# Altium schematic sheet DigitalCarrierJack.SchDoc
size A4; CompanyName: Technische Hochschule Nürnberg Georg Simon Ohm; DrawnBy: Bauer Martin; Engineer: Bauer Martin; Organization: UltraZohm; Address1: Kesslerplatz 12; Address2: 90489 Nürnberg; Address3: GERMANY; DocumentNumber: 2; SheetNumber: 2; SheetTotal: 6; Website: www.ultrazohm.com
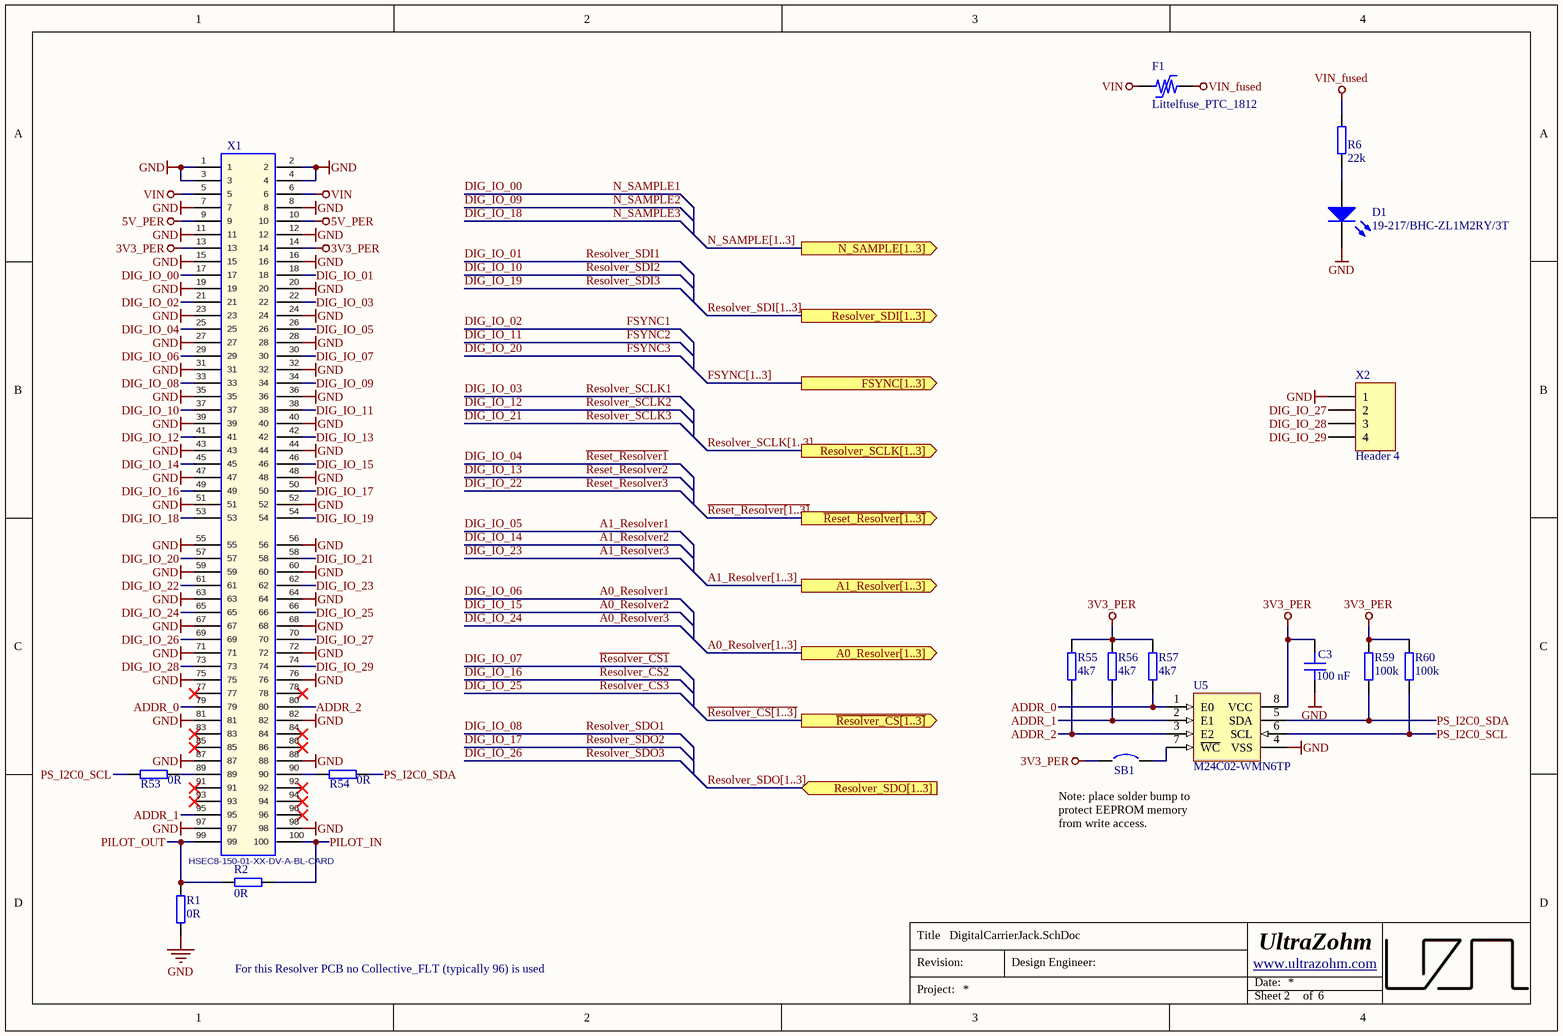
[diagram p0: DigitalCarrierJack.SchDoc]

## Parts
C3  100 nF  [C_0603]
D1  19-217/BHC-ZL1M2RY/3T  [WL-SMCW_0603]
F1  Littelfuse_PTC_1812  [1812_PTC_Polyfuse_Littelfuse]
R1  0R  [RES 0603_1608]
R2  0R  [RES 0603_1608]
R6  22k  [RES 0603_1608]
R53  0R  [RES 0603_1608]
R54  0R  [RES 0603_1608]
R55  4k7  [RES 0603_1608]
R56  4k7  [RES 0603_1608]
R57  4k7  [RES 0603_1608]
R59  100k  [RES 0603_1608]
R60  100k  [RES 0603_1608]
SB1  Solder Bump 0603  [SB_0603]  (value not drawn)  (no BOM)
U5  M24C02-WMN6TP  [D0008A_N]
X1  HSEC8-150-01-XX-DV-A-BL-CARD  [HSEC8-150-01-XX-DV-A-BL-CARD]  (no BOM)
X2  Header 4  [HDR1X4]

## Ports
A0_Resolver[1..3] (out), A1_Resolver[1..3] (out), FSYNC[1..3] (out), N_SAMPLE[1..3] (out), Resolver_SCLK[1..3] (out), Resolver_SDI[1..3] (out), Resolver_SDO[1..3] (in), ~{Reset_Resolver[1..3]} (out), ~{Resolver_CS[1..3]} (out)

## Nets
3V3_PER: C3.1 R55.2 R56.2 R57.2 R59.2 R60.2 SB1.1 U5.8(VCC) X1.13 X1.14
5V_PER: X1.9 X1.10
GND: C3.2 D1.1(K) R1.1 U5.4(VSS) X1.1 X1.2 X1.3 X1.4 X1.7 X1.8 X1.11 X1.12 X1.15 X1.16 X1.19 X1.20 X1.23 X1.24 X1.27 X1.28 X1.31 X1.32 X1.35 X1.36 X1.39 X1.40 X1.43 X1.44 X1.47 X1.48 X1.51 X1.52 X1.55 X1.56 X1.59 X1.60 X1.63 X1.64 X1.67 X1.68 X1.71 X1.72 X1.75 X1.76 X1.81 X1.82 X1.87 X1.88 X1.97 X1.98 X2.1
VIN: F1.1 X1.5 X1.6
VIN_fused: F1.2 R6.2
~{Reset_Resolver1}: X1.25  [also labelled DIG_IO_04]
~{Reset_Resolver2}: X1.42  [also labelled DIG_IO_13]
~{Reset_Resolver3}: X1.61  [also labelled DIG_IO_22]
~{Resolver_CS1}: X1.30  [also labelled DIG_IO_07]
~{Resolver_CS2}: X1.49  [also labelled DIG_IO_16]
~{Resolver_CS3}: X1.66  [also labelled DIG_IO_25]
A0_Resolver1: X1.29  [also labelled DIG_IO_06]
A0_Resolver2: X1.46  [also labelled DIG_IO_15]
A0_Resolver3: X1.65  [also labelled DIG_IO_24]
A1_Resolver1: X1.26  [also labelled DIG_IO_05]
A1_Resolver2: X1.45  [also labelled DIG_IO_14]
A1_Resolver3: X1.62  [also labelled DIG_IO_23]
ADDR_0: R57.1 U5.1(E0) X1.79
ADDR_1: R56.1 U5.2(E1) X1.95
ADDR_2: R55.1 U5.3(E2) X1.80
DIG_IO_00: X1.17  [also labelled N_SAMPLE1]
DIG_IO_01: X1.18  [also labelled Resolver_SDI1]
DIG_IO_02: X1.21  [also labelled FSYNC1]
DIG_IO_03: X1.22  [also labelled Resolver_SCLK1]
DIG_IO_08: X1.33  [also labelled Resolver_SDO1]
DIG_IO_09: X1.34  [also labelled N_SAMPLE2]
DIG_IO_10: X1.37  [also labelled Resolver_SDI2]
DIG_IO_11: X1.38  [also labelled FSYNC2]
DIG_IO_12: X1.41  [also labelled Resolver_SCLK2]
DIG_IO_17: X1.50  [also labelled Resolver_SDO2]
DIG_IO_18: X1.53  [also labelled N_SAMPLE3]
DIG_IO_19: X1.54  [also labelled Resolver_SDI3]
DIG_IO_20: X1.57  [also labelled FSYNC3]
DIG_IO_21: X1.58  [also labelled Resolver_SCLK3]
DIG_IO_26: X1.69  [also labelled Resolver_SDO3]
DIG_IO_27: X1.70 X2.2
DIG_IO_28: X1.73 X2.3
DIG_IO_29: X1.74 X2.4
PILOT_IN: R2.2 X1.100
PILOT_OUT: R1.2 R2.1 X1.99
PS_I2C0_SCL: R53.1 R60.1 U5.6(SCL)
PS_I2C0_SDA: R54.2 R59.1 U5.5(SDA)
NetD1_2: D1.2(A) R6.1
NetR53_2: R53.2 X1.89
NetR54_1: R54.1 X1.90
NetSB1_2: SB1.2 U5.7(~{WC})

Not connected (* = marked no-connect by the designer): X1 77* 78* 83* 84* 85* 86* 91* 92* 93* 94* 96*

## Buses and harness runs
bus A0_Resolver[1..3] = port A0_Resolver[1..3]
bus A1_Resolver[1..3] = port A1_Resolver[1..3]
bus FSYNC[1..3] = port FSYNC[1..3]
bus N_SAMPLE[1..3] = port N_SAMPLE[1..3]
bus Resolver_SCLK[1..3] = port Resolver_SCLK[1..3]
bus Resolver_SDI[1..3] = port Resolver_SDI[1..3]
bus Resolver_SDO[1..3] = port Resolver_SDO[1..3]
bus ~{Reset_Resolver[1..3]} = port ~{Reset_Resolver[1..3]}
bus ~{Resolver_CS[1..3]} = port ~{Resolver_CS[1..3]}

## Notes on the sheet
- Note: place solder bump to protect EEPROM memory from write access.
- For this Resolver PCB no Collective_FLT (typically 96) is used
- Title
- Revision:
- Design Engineer:
- Date:
- Project:
- Sheet
- of

## Library data of the parts
C3 = C0603C104K9PACTU: Capacitor 0603, 6.3 VDC, 100 nF, X5R; Manufacturer: KEMET; Tolerance: 10 %; Voltage Rating: 6.3 VDC; Created from: MGremer; Manufacturer Part Number: C0603C104K9PACTU; PartID: 70; Created On: 20.12.2020 13:54:13; ComponentLink1Description: Datasheet; ComponentLink1URL: https://www.mouser.de/datasheet/2/212/KEM_C1006_X5R_SMD-1103249.pdf; Component Type: Capacitor 0603; Device Package: 0603; Last Updated: 20.01.2021 13:57:36; Mounting Type: SMD; Operating Temperature: -55 - 85°C; Series: SMD Comm X5R; Supplier 1: Mouser; Supplier Part Number 1: 80-C0603C104K9P; Type: Capacitor; Value: 100 nF; Live Cycle Status: 1; Stock number: not stored
D1 = 19-217/BHC-ZL1M2RY/3T: LED BLUE 465~475NM 11.5~28.5MCD@5MA TOP VIEW 0603 ROHS; Manufacturer: Everlight Elec; Type: Standard; Created from: T. Wendt; Forward Current I_f: 20 mA; Forward Voltage U_f: 2.8 V; Wavelength: 470 nm; Nominal Power: 68 mW; Manufacturer Part Number: 19-217/BHC-ZL1M2RY/3T; PartID: 6; Created On: 03.03.2021 09:59:51; ComponentLink1Description: Datasheet; ComponentLink1URL: https://datasheet.lcsc.com/szlcsc/Everlight-Elec-19-217-BHC-ZL1M2RY-3T_C72041.pdf; Component Type: LED Diode; Device Package: 0603; Last Updated: 04.03.2021 09:02:49; Mounting Type: SMD; Operating Temperature: -40 - 85 °C; Supplier 1: LCSC; Supplier Part Number 1: C72041; Live Cycle Status: 1; Stock number: not stored; Color: blue; Light Intensity: 28.5 mcd; LCSC Part Number: C72041
F1 = Littelfuse_PTC_1812: POLYSWITCH RESETTABLE DEVICES; MPN: miniASMDC110F/24; Value: PTC, 1.1 A, 24V; Voltage: 24V; Trip Current: 2.2A; Hold Current: 1.1A; Resistance: 0.18 Ohm; Type: Fuse; Nominal current: 1 A; Created from: MHlatky; MF: Littelfuse; Created: 2019_02_10_AGeiger; Package: 1812; ComponentLink1URL: https://www.littelfuse.com/~/media/electronics/datasheets/resettable_ptcs/littelfuse_ptc_surface_mount_catalog_datasheet.pdf.pdf; ComponentLink1Description: Datasheet; Manufacturer Part Number: Littelfuse_PTC_1812; PartID: 5; Created On: 07.05.2021 06:50:33; Component Type: Littelfuse_PTC_1812; Last Updated: 27.05.2022 15:06:17; Manufacturer: Littelfuse; Mounting Type: SMD; Operating Temperature: -40 - 85 °C; Supplier 1: Mouser; Supplier Part Number 1: 530-0ZCG0150BF2C; Live Cycle Status: 1; LCSC Part Number: C70119
R1 R2 R53 R54 = RC0603JR-070RL: SMD resistor E24 series; Manufacturer: YAGEO; Tolerance: 5%; Created from: MGremer; Supplier 1: Mouser; ComponentLink1Description: Datasheet; ComponentLink1URL: https://www.mouser.de/datasheet/2/447/PYu-RC_Group_51_RoHS_L_10-1664068.pdf; Value: 0R; Supplier Part Number 1: 603-RC0603JR-070RL; Manufacturer Part Number: RC0603JR-070RL; PartID: 1; Created On: 14.12.2020 16:17:14; Component Type: SMD resistor; Device Package: 0603; Last Updated: 04.03.2021 09:09:42; Mounting Type: SMD; Supplier 2: LCSC; Supplier Part Number 2: C21189; Type: Resistor; Live Cycle Status: 1; Stock number: Labor SMD Container; LCSC Part Number: C21189
R6 = RK73B1JTTD223J: SMD resistor E24 series; Manufacturer: KOA Speer; Tolerance: 5%; Created from: MGremer; Value: 22k; Supplier 1: Mouser; Supplier Part Number 1: 660-RK73B1JTTD223J; Manufacturer Part Number: RK73B1JTTD223J; PartID: 106; Created On: 14.12.2020 16:17:14; ComponentLink1Description: Datasheet; ComponentLink1URL: https://www.mouser.de/datasheet/2/219/RK73B-1825463.pdf; Component Type: SMD resistor; Device Package: 0603; Last Updated: 01.02.2023 09:52:31; Mounting Type: SMD; Type: Resistor; Live Cycle Status: 1; Stock number: Labor SMD Container; LCSC Part Number: C31850
R55-R57 = 0603WAF4701T5E: SMD resistor E24 series; Manufacturer: UNI-ROYAL; Tolerance: 1%; Created from: AGeiger; Manufacturer Part Number: 0603WAF4701T5E; PartID: 90; Created On: 14.12.2020 16:17:14; ComponentLink1Description: Datasheet; ComponentLink1URL: https://datasheet.lcsc.com/lcsc/2206010116_UNI-ROYAL-Uniroyal-Elec-0603WAF4701T5E_C23162.pdf; Component Type: SMD resistor; Device Package: 0603; Last Updated: 25.08.2022 20:03:04; Mounting Type: SMD; Supplier 1: LCSC; Supplier Part Number 1: C23162; Type: Resistor; Value: 4k7; Live Cycle Status: 1; Stock number: Labor SMD Container; LCSC Part Number: C23162
R59 R60 = RK73B1JTTD104J: SMD resistor E24 series; Manufacturer: KOA Speer; Tolerance: 5%; Created from: MGremer; Manufacturer Part Number: RK73B1JTTD104J; PartID: 122; Created On: 14.12.2020 16:17:14; ComponentLink1Description: Datasheet; ComponentLink1URL: https://www.mouser.de/datasheet/2/219/RK73B-1825463.pdf; Component Type: SMD resistor; Device Package: 0603; Last Updated: 27.05.2022 14:04:10; Mounting Type: SMD; Supplier 1: Mouser; Supplier Part Number 1: 660-RK73B1JTTD104J; Type: Resistor; Value: 100k; Live Cycle Status: 1; Stock number: Labor SMD Container; LCSC Part Number: C25803
SB1 = =Value: Created from: AGeiger; Revision: July-2002: Re-released for DXP Platform.; PartID: 1; Created On: 09.01.2024 17:13:56; Component Type: Solder Bump; Device Package: 0603; Last Updated: 09.01.2024 17:13:56; Manufacturer Part Number: Solder Bump 0603; Mounting Type: SMD; Value: Solder Bump 0603
U5 = M24C02-WMN6TP: 2Kbit I2C SOP-8 EEPROM ROHS; Manufacturer: STMicroelectronics; Created from: AGeiger; Manufacturer Part Number: M24C02-WMN6TP; PartID: 1; Created On: 19.11.2023 14:54:27; ComponentLink1Description: Datasheet; ComponentLink1URL: https://www.st.com/resource/en/datasheet/m24c01-w.pdf; Component Type: EEPROM; Device Package: SOIC-8; Last Updated: 19.11.2023 21:39:04; Mounting Type: SMD; Operating Temperature: -40 to +85 °C; Series: M24xxx; Supplier 1: Mouser; Supplier Part Number 1: 511-M24C02-WMN6TP; Supplier 2: LCSC; Supplier Part Number 2: C7562; Type: Memory; Value: M24C02-WMN6TP; LCSC Part Number: C7562
X1 = HSEC8-150-01-XX-DV-A-BL-CARD: Mating Card Layout for HSEC8-150-01-XX-DV-A-BL; Manufacturer: SAMTEC; Created: 2018_04_23_AGeiger; Value: HSEC8-150-01-XX-DV-A-BL-CARD
X2 = Header 4: Header, 4-Pin; LatestRevisionDate: 17-Jul-2002; LatestRevisionNote: Re-released for DXP Platform.; Publisher: Altium Limited